# Altium schematic sheet Buck_Boost_Converter_A.SchDoc
size A4; SheetNumber: 7; SheetTotal: 10
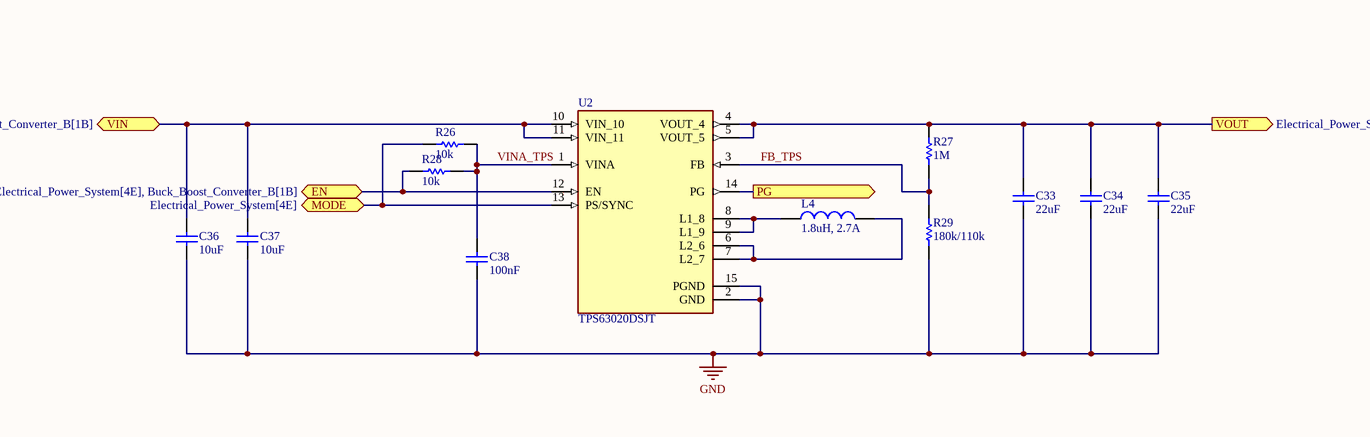
[diagram p0: Buck_Boost_Converter_A.SchDoc, left]
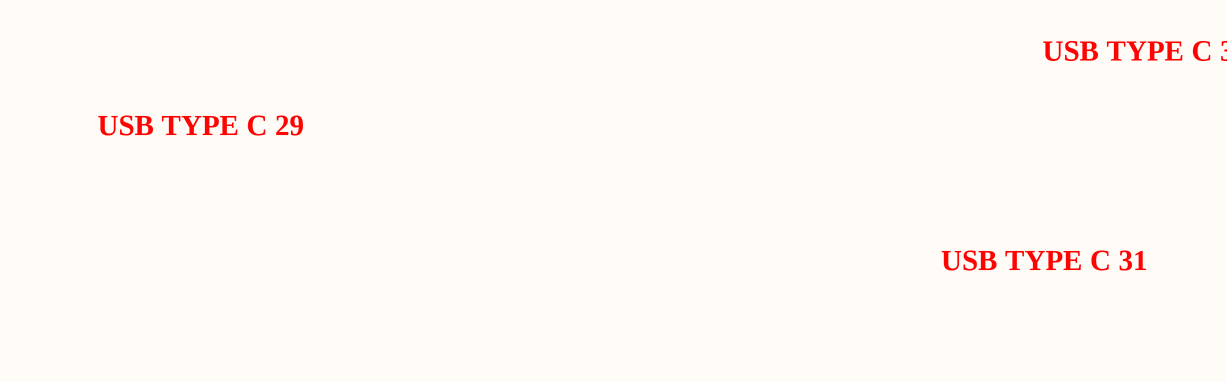
[diagram p1: Buck_Boost_Converter_A.SchDoc, right]

## Parts
C33  value 22uF  [CAP-SM-0603]  (hidden comment: Cap Non-Pol SMD)
C34  value 22uF  [CAP-SM-0603]  (hidden comment: Cap Non-Pol SMD)
C35  value 22uF  [CAP-SM-0603]  (hidden comment: Cap Non-Pol SMD)
C36  value 10uF  [CAP-SM-0603]  (hidden comment: Cap Non-Pol SMD)
C37  value 10uF  [CAP-SM-0603]  (hidden comment: Cap Non-Pol SMD)
C38  value 100nF  [CAP-SM-0603]  (hidden comment: Cap Non-Pol SMD)
L4  1.8uH, 2.7A  [WE-PD2A_4532]
R26  value 10k  [RES-SM-0603]  (hidden comment: RESISTOR SMD)
R27  value 1M  [RES-SM-0603]  (hidden comment: RESISTOR SMD)
R28  value 10k  [RES-SM-0603]  (hidden comment: RESISTOR SMD)
R29  value 180k/110k  [RES-SM-0603]  (hidden comment: RESISTOR SMD)
U2  TPS63020DSJT  [IC_TPS63020DSJT]

## Ports
EN (bidir, see Electrical_Power_System[4E], Buck_Boost_Converter_B[1B]), MODE (bidir, see Electrical_Power_System[4E]), PG (out, see Electrical_Power_System[4E]), VIN (bidir, see Electrical_Power_System[4E], Buck_Boost_Converter_B[1B]), VOUT (out, see Electrical_Power_System[3E])

## Nets
GND: C33.1 C34.1 C35.1 C36.1 C37.1 C38.1 R29.1 U2.2(GND) U2.15(PGND)
EN: R28.2 U2.12(EN) ; port EN
FB_TPS: R27.1 R29.2 U2.3(FB)
MODE: R26.2 U2.13(PS/SYNC) ; port MODE
PG: U2.14(PG) ; port PG
VIN: C36.2 C37.2 U2.10(VIN_10) U2.11(VIN_11) ; port VIN
VINA_TPS: C38.2 R26.1 R28.1 U2.1(VINA)
VOUT: C33.2 C34.2 C35.2 R27.2 U2.4(VOUT_4) U2.5(VOUT_5) ; port VOUT
NetL4_1: L4.1 U2.8(L1_8) U2.9(L1_9)
NetL4_2: L4.2 U2.6(L2_6) U2.7(L2_7)

## Notes on the sheet
- USB TYPE C 30
- USB TYPE C 29
- USB TYPE C 31

## Library data of the parts
C33-C38 = Cap Non-Pol SMD: Capacitor
L4 = 784773018: WE-PD2A SMT Power Inductor, size 4532, 1.8uH, 2.7A; Manufacturer: Wurth Elektronik; DC Resistance max.: 0.064Ohm; Saturation Current: 3.6A; Self Resonant Frequency: 85MHz; DC Resistance typ.: 0.028Ohm; Rated Voltage: 80VDC; ComponentLink1Description: Datasheet; ComponentLink1URL: https://www.we-online.com/catalog/datasheet/784773018.pdf; Manufacturer Part Number: 784773018; Published Date: May 2020; Rated Current: 2.7A; Inductance: 1.8uH; Operating Temperature: -40 to +125degC; Packaging: Tape and Reel; Size: 4532; Supplier 2 URL: https://www.digikey.com/en/products/detail/w%C3%BCrth-elektronik/784773018/5168841?s=N4IgTCBcDaIOwA4Asc4GYAMBGBIC6AvkA; Supplier 1 URL: https://www.mouser.vn/ProductDetail/Wurth-Elektronik/784773018?qs=sBf%2Fb4nBSleQ5H1IVXBHSg%3D%3D; Supplier 3 URL: N/A; Value: 1.8uH, 2.7A; LCSC Part #: N/A; Supplier 1: Mouser; Supplier 1 Part Number: 710-784773018; Supplier 2: Digi-Key; Supplier 2 Part Number: 732-6804-2-ND; Supplier 3: thegioiic; Supplier 3 Part Number: N/A; Mount: SMD/SMT
R26-R29 = RESISTOR SMD: Resistor
U2 = TPS63020DSJT: High Efficiency Single Inductor Buck-Boost Converter with 4A Switch 14-VSON -40 to 85; MF: Texas Instruments; Value: *; SnapEDA_Link: https://www.snapeda.com/parts/TPS63020DSJT/Texas%20Instruments/view-part/225125/?ref=snap; Texas_Instruments-Purchase-URL: https://snapeda.com/shop?store=Texas+Instruments&id=225125; Arrow_Asia-Purchase-URL: https://snapeda.com/shop?store=Arrow+Asia&id=225125; Mouser-Purchase-URL: https://snapeda.com/shop?store=Mouser&id=225125; Availability: Good; Price: None; Package: VSON-14 Texas Instruments; DigiKey-Purchase-URL: https://snapeda.com/shop?store=DigiKey&id=225125; MP: TPS63020DSJT